# Altium schematic sheet motion_tracker.SchDoc
size A3; SheetNumber: 1; SheetTotal: 1
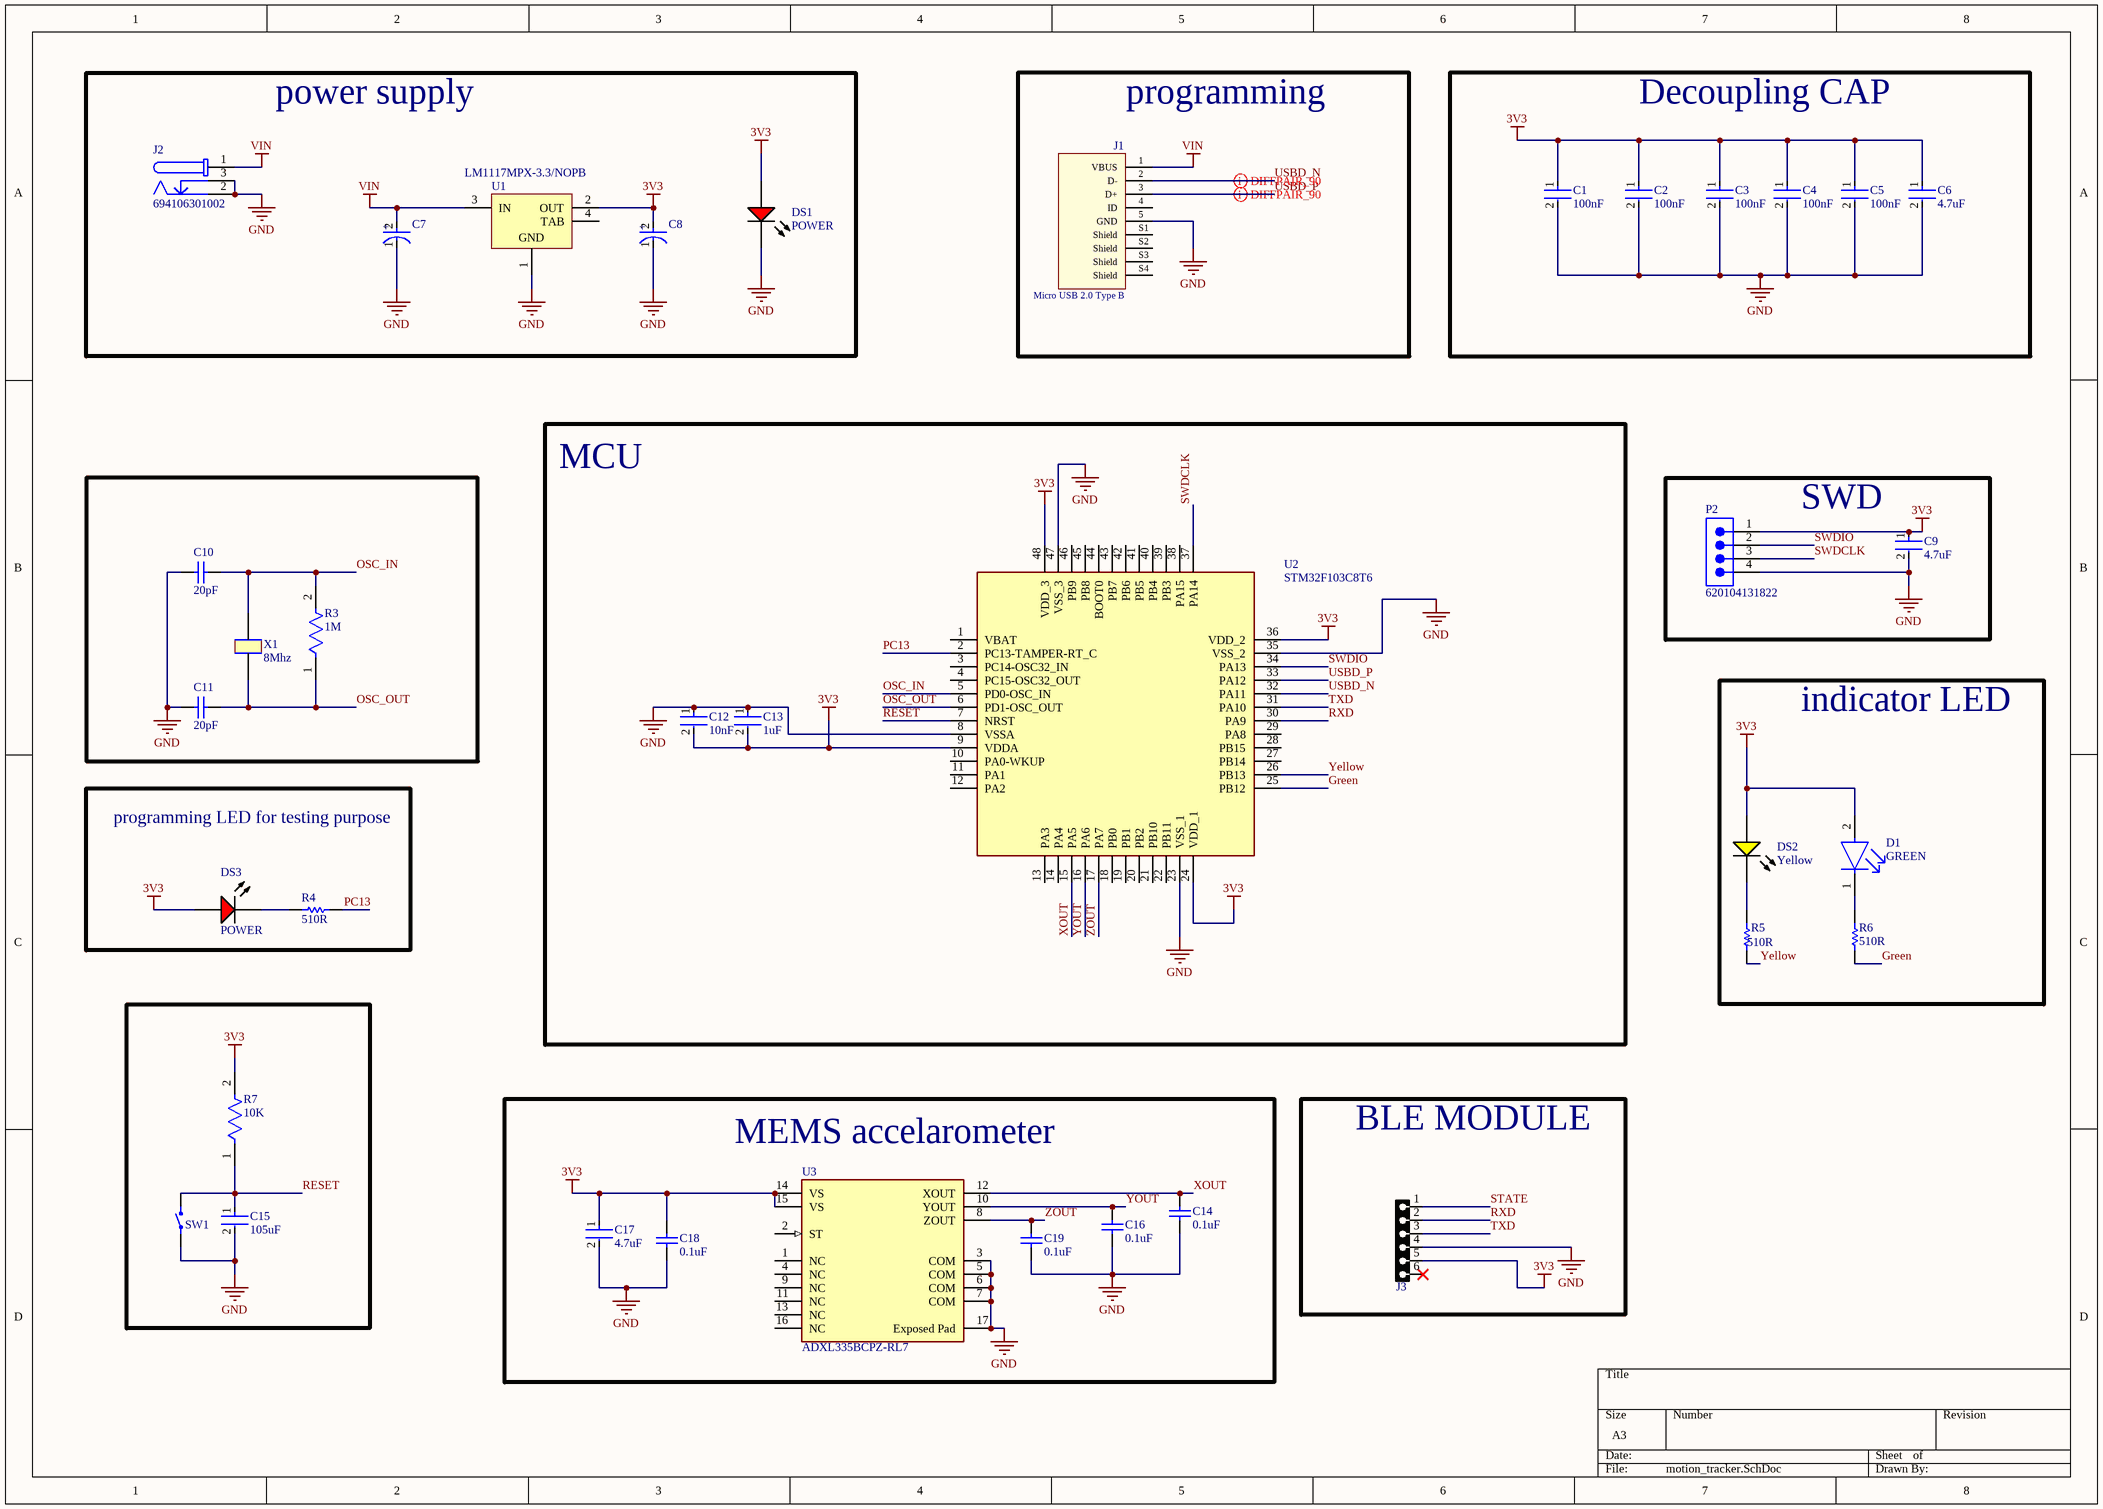
[diagram p0: motion_tracker.SchDoc]

## Parts
C1  100nF  [FP-0603-L_1_6_0_15-W_0_81-IPC_C]
C2  100nF  [FP-0603-L_1_6_0_15-W_0_81-IPC_C]
C3  100nF  [FP-0603-L_1_6_0_15-W_0_81-IPC_C]
C4  100nF  [FP-0603-L_1_6_0_15-W_0_81-IPC_C]
C5  100nF  [FP-0603-L_1_6_0_15-W_0_81-IPC_C]
C6  4.7uF  [FP-0603-L_1_6_0_15-W_0_81-IPC_A]
C7  EEEFP1C100AR  [FP-FPB-MFG]  (value not drawn)
C8  EEEFP1C100AR  [FP-FPB-MFG]  (value not drawn)
C9  4.7uF  [FP-0603-L_1_6_0_15-W_0_81-IPC_A]
C10  20pF  [CAPC1608X90X35NL15T15]
C11  20pF  [CAPC1608X90X35NL15T15]
C12  10nF  [FP-0603-L_1_6_0_15-W_0_81-IPC_C]
C13  1uF  [FP-0603-L_1_6_0_15-W_0_81-IPC_C]
C14  0.1uF  [CAPC1608X90X35LL15T15]
C15  105uF  [FP-0603-L_1_6_0_15-W_0_81-IPC_C]
C16  0.1uF  [CAPC1608X90X35LL15T15]
C17  4.7uF  [FP-0603-L_1_6_0_15-W_0_81-IPC_A]
C18  0.1uF  [CAPC1608X90X35LL15T15]
C19  0.1uF  [CAPC1608X90X35LL15T15]
D1  GREEN  [FP-LTST-C190GKT-MFG]
DS1  POWER  [AVAG-HSMX-C190_V]
DS2  Yellow  [AVAG-HSMX-C190_V]
DS3  POWER  [AVAG-HSMX-C190_V]
J1  Micro USB 2.0 Type B  [629105136821]
J2  694106301002  [694106301002]
J3  HDRF6  [HDRLP_F_1X6]  (value not drawn)
P2  620104131822  [620104131822]
R3  1M  [FP-ERJ3EK-IPC_C]
R4  510R  [RESC1608X55X30ML15T15]
R5  510R  [RESC1608X55X30ML15T15]
R6  510R  [RESC1608X55X30ML15T15]
R7  10K  [FP-CRCW0603-HPe3-MFG]
SW1  Tactile 2PIN 6X3.5mm H4.57mm (SMD)  [SWPBS_SPST_6X3X5]  (value not drawn)
U1  LM1117MPX-3.3/NOPB  [DCY0004A_L]
U2  STM32F103C8T6  [LQFP-48_19.6_393_58X11_SMD]
U3  ADXL335BCPZ-RL7  [FP-CP-16-14-MFG]
X1  8Mhz  [XTAL_314_240X47_SMD]

## Blocks framed on the sheet
power supply: C7 C8 DS1 J2 U1
programming: J1
Decoupling CAP: C1-C6
MCU: C12 C13 U2
SWD: C9 P2
indicator LED: D1 DS2 R5 R6
programming LED for testing purpose: DS3 R4
MEMS accelarometer: C14 C16-C19 U3
BLE MODULE: J3

## Nets
3V3: C1.1 C2.1 C3.1 C4.1 C5.1 C6.1 C8.2(A) C9.1 C12.2 C13.2 C17.1 C18.2 D1.2(A) DS1.1(A) DS2.1(A) DS3.1(A) J3.5 P2.1 R7.2 U1.2(OUT) U2.9(VDDA) U2.24(VDD_1) U2.36(VDD_2) U2.48(VDD_3) U3.14(VS) U3.15(VS)
GND: C1.2 C2.2 C3.2 C4.2 C5.2 C6.2 C7.1(C) C8.1(C) C9.2 C10.1 C11.1 C12.1 C13.1 C14.1 C15.2 C16.1 C17.2 C18.1 C19.1 DS1.2(K) J1.5(GND) J2.2 J2.3 J3.4 P2.4 SW1.1 U1.1(GND) U2.8(VSSA) U2.23(VSS_1) U2.35(VSS_2) U2.47(VSS_3) U3.3(COM) U3.5(COM) U3.6(COM) U3.7(COM) U3.17(Exposed_Pad)
VIN: C7.2(A) J1.1(VBUS) J2.1 U1.3(IN)
Green: R6.2 U2.25(PB12)
OSC_IN: C10.2 R3.2 U2.5(PD0-OSC_IN) X1.2
OSC_OUT: C11.2 R3.1 U2.6(PD1-OSC_OUT) X1.1
PC13: R4.2 U2.2(PC13-TAMPER-RT_C)
RESET: C15.1 R7.1 SW1.2 U2.7(NRST)
RXD: J3.2 U2.30(PA9)
STATE: J3.1
SWDCLK: P2.3 U2.37(PA14)
SWDIO: P2.2 U2.34(PA13)
TXD: J3.3 U2.31(PA10)
USBD_N: J1.2(D-) U2.32(PA11)
USBD_P: J1.3(D+) U2.33(PA12)
XOUT: C14.2 U2.15(PA5) U3.12(XOUT)
Yellow: R5.2 U2.26(PB13)
YOUT: C16.2 U2.16(PA6) U3.10(YOUT)
ZOUT: C19.2 U2.17(PA7) U3.8(ZOUT)
NetD1_1: D1.1(C) R6.1
NetDS2_2: DS2.2(K) R5.1
NetDS3_2: DS3.2(K) R4.1

Not connected (* = marked no-connect by the designer): J1 4(ID) S1(Shield) S2(Shield) S3(Shield) S4(Shield); J3 6*; U1 4(TAB); U2 1(VBAT) 3(PC14-OSC32_IN) 4(PC15-OSC32_OUT) 10(PA0-WKUP) 11(PA1) 12(PA2) 13(PA3) 14(PA4) 18(PB0) 19(PB1) 20(PB2) 21(PB10) 22(PB11) 27(PB14) 28(PB15) 29(PA8) 38(PA15) 39(PB3) 40(PB4) 41(PB5) 42(PB6) 43(PB7) 44(BOOT0) 45(PB8) 46(PB9); U3 1(NC) 2(ST) 4(NC) 9(NC) 11(NC) 13(NC) 16(NC)

## Layout directives
differential pair; net class diff_90; differential pair class diff_90: USBD_N, USBD_P

## Notes on the sheet
- (in symbol CMP-00287-07742837-1) +

## Library data of the parts
C1-C5 C12 C13 C15 = CMP-2006-04386-2: Automotive Ceramic Capacitor, 0603, 100nF, 10%, X7R, 15%, 50V; Dissipation Factor: 2.5%; Insulation Resistance: 100GR; Package Quantity: 1; Radiation Hardening: No; Contact Plating: Tin; Width: 0.032inch; Voltage Rating (DC): 50V; Dielectric Material: Ceramic; Length: 1.6mm; Thickness: 0.035inch; Min Operating Temperature: -55°C; Voltage: 50V; Depth: 0.81mm; Max Operating Temperature: 125°C; Series: -; Dielectric: X7R; Tolerance: 10%; Mount: Surface Mount; Termination: SMD/SMT; Ratings: AEC-Q200; Lead Free: Lead Free; Case Code (Imperial): 0603; Case/Package: 0603; Voltage Rating: 50V; Case Code (Metric): 1608; Capacitance: 100nF; RoHS Compliant: Yes; Number of Pins: 2; REACH SVHC: No SVHC; Construction: Flat; Height: 0.9mm; Packaging: Tape and Reel
C6 C9 C17 = CMP-2006-04482-2: General Purpose Ceramic Capacitor, 0603, 4.7uF, 20%, X5R, 15%, 6.3V; Insulation Resistance: 10GR; Dissipation Factor: 12.5%; Case/Package: 0603; Lead Free: Lead Free; Series: -; Size: 0.94mm; Min Operating Temperature: -55°C; Construction: Flat; Thickness: 0.035inch; RoHS Compliant: Yes; Mount: Surface Mount; Voltage Rating (DC): 6.3V; Termination: SMD/SMT; Length: 1.6mm; Depth: 0.81mm; Radiation Hardening: No; Tolerance: 20%; Height: 0.9mm; Capacitance: 4.7uF; Dielectric Material: Ceramic; Number of Pins: 2; Contact Plating: Tin; Width: 0.032inch; Case Code (Imperial): 0603; Voltage Rating: 6.3V; REACH SVHC: No SVHC; Package Quantity: 1; Max Operating Temperature: 85°C; Voltage: 6.3V; Case Code (Metric): 1608; Packaging: Tape and Reel; Dielectric: X5R
C7 C8 = CMP-00287-07742837-1: EEEFP1C100AR Aluminum Electrolytic Capacitor, 10 uF, 16 V, ± 20%, 2000 hours @ 105°C, Radial Can - SMD; Leakage Current: 3µA; Voltage Rating: 16V; ESR (Equivalent Series Resistance): 850mΩ; Capacitance: 10µF; Ripple Current (AC): 160mA; Dissipation Factor: 16%; Material: Aluminium; Height: 5.8mm; Min Operating Temperature: -55°C; Case/Package: Radial; Packaging: Cut Tape; Lifecycle Status: Production; Lead Pitch: 1mm; Tolerance: 20%; Contact Plating: Tin; Diameter: 4mm; Lead Free: Lead Free; Voltage: 16V; Max Operating Temperature: 105°C; Voltage Rating (DC): 16V; Height - Seated (Max): 5.7912mm; Schedule B: 8532220020, 8532220020; Termination: SMD/SMT; Number of Pins: 2; RoHS: Compliant; REACH SVHC: No SVHC; Ripple Current: 160mA; Mount: PCB, Surface Mount; Radiation Hardening: No; Life (Hours): 2000hours; Features: High Temperature; NexarPartId: 7742837; Length: 6.1mm
C10 C11 = CMP-2006-04264-1: Part Number: 06035A200JAT2A; Manufacturer: AVX Interconnect / Elco
C14 C16 C18 C19 = CMP-2006-02168-1: Manufacturer: AVX Interconnect / Elco; Part Number: LD035C104KAB2A
D1 = CMP-22017-000005-2: LED GREEN CLEAR CHIP SMD; Dominant Wavelength: 569nm; Reverse Voltage: 5V; Lens Color: Colorless; Viewing Angle: 130°; Voltage: 2V; Forward Current: 30mA; Power Dissipation: 100mW; Luminous Intensity: 6mcd; Number of LEDs: 1; Forward Voltage: 2.1V; Wavelength: 565nm; Test Current: 10mA; Min Operating Temperature: -55°C; Lens Style: Clear; Mount: Surface Mount; Width: 0.8mm; Packaging: Tape and Reel; Lens Transparency: Clear; Case Code (Metric): 1608; Depth: 0.8mm; Case Code (Imperial): 0603; Case/Package: 0603; Number of Pins: 2; Max Operating Temperature: 85°C; Lead Free: Lead Free; Number of Elements: 1; Length: 1.6mm; Height: 0.8mm; Package Quantity: 1; Power Rating: 100mW; Radiation Hardening: No; Illumination Color: Green; Color: Green
DS1 DS3 = CMP-2000-06427-1: LED Uni-Color Red, 52 mW, 20 mA, -40 to 85 degC, 2-Pin SMD, RoHS, Tape and Reel; Manufacturer: Avago; Reverse Voltage: 5V; Viewing Angle: 170deg; High Brightness: No; Lens Type: ColorlessDiffused; DELETED: Compliant; Product Height (mm): 0.8mm; Dominant Wave Length: 626nm; Number of  Elements: 1; Chip Material: GaP; Lum Intensity: 10mcd; Product Length (mm): 1.6mm; Forward Voltage: 2.6V; Power Dissipation: 52W; Shape Type: Rectangular; Forward Current: 25mA; Peak Wavelength: 630nm; Test Current (It): 20mA; Main Category: ChipLED; Lens Dimensions: 1x0.8x0.5mm; Pin Count: 2; Package Reference: HSMX-C190; Mounting Technology: SurfaceMount; Mounting: SurfaceMount; Datasheet URL: http://docs.avagotech.com/docs/AV02-0551EN; Package Type: ChipLed; Operating Temperature Classification: Industrial; Datasheet Version: 03/2012; Operating Temp Range: -40Cto85C; Emitting Color: Red; Rad Hardened: No; Manufacturer URL: http://www.avagotech.com/; Luminous Intensity: 10mcd; Package Description: 2-Pin Surface Mount Device, Body 1.6 x 0.8 mm, Height 0.9 mm; Type: Uni-Color; Packaging: TapeandReel; Product Depth (mm): 0.8mm
DS2 = CMP-1744-00003-1: LED Uni-Color Yellow, 65 mW, 20 mA, -40 to 85 degC, 2-Pin SMD, RoHS, Tape and Reel; Tolerance: 1%; Voltage Rating: 50 V; Power Rating: 100 mW; Case\Package: 0603; Resistance: 390 Ohm; Min Operating Temperature: -55 degC; Length: 1.6 mm; ComponentLink3Description: Package Specification; Mount: Surface Mount; PackageReference: HSMX-C190; ComponentLink2Description: Datasheet; DatasheetVersion: Mar-12; Case Code (Metric): 1608; Pins: 2; Package Quantity: 5000; ComponentLink2URL: http://docs.avagotech.com/docs/AV02-0551EN; ComponentLink1Description: Manufacturer URL; RoHSCompliant: true; Packaging: Tape and Reel; PackageDescription: 2-Pin Surface Mount Device, Body 1.6 x 0.8 mm, Height 0.9 mm; REACH SVHC: No SVHC; ComponentLink3URL: http://www.fairchildsemi.com/dwg/MA/MA03D.pdf; Voltage Rating (DC): 50 V; Width: 0.8 mm; ComponentLink1URL: http://www.avagotech.com/; Max Operating Temperature: 155 degC; Case Code (Imperial): 0603; Height: 0.45 mm
J1 = Micro USB 2.0 Type B Horizonta (SMD) 629105136821: Micro USB 2.0 Type B Horizontal SMT 5 Contacts WR-COM; Rated Current: 1 A; Gender: Female; ComponentLink1Description: Manufacturer; ComponentLink1URL: http://www.we-online.de; ComponentLink2Description: Datasheet; ComponentLink2URL: http://katalog.we-online.de/em/datasheet/629105136821.pdf; PartNumber: 629105136821; Published Date: May 2018; Publisher: Wurth Elektronik; Orientation: Horizontal; Interface Type: Micro USB 2.0 Type B; Operating Temperature: -40 to 85 degC; Mounting Technology: SMT; Packaging: Tape and Reel
J2 = CMP-1502-00188-2: NexarPartId: 52676100; Voltage Rating (DC): 20V; Gender: Male; Voltage Rating: 24V; Connector Type: Power; Insulation Resistance: 100MΩ; Current Rating: 5A; Shielding: Unshielded; Number of Contacts: 3; Color: Black; Housing Material: Polyamide; Contact Gender: Female; REACH SVHC: Unknown; Termination: Through Hole; Height: 11mm; RoHS: Compliant; Mount: Through Hole; Flammability Rating: UL94 V-0; Packaging: Bulk; Min Operating Temperature: -40°C; Contact Plating: Tin; Max Operating Temperature: 85°C; Operating Supply Voltage: 24V; Contact Material: Gold, Tin
J3 = HDRLP_F_1X6: CONN, HEADER, Male, pitch: 2.54mm, 6POS; VALUE: HDRF6
P2 = CMP-1502-00671-2: NexarPartId: 18818240; Number of Positions: 4; Operating Supply Voltage: 100V; Connector Type: Male Pin; Insulation: Insulated; Pitch: 2mm; Insulation Resistance: 1GΩ; Contact Resistance: 20mΩ; Voltage Rating: 125V; Current Rating: 2A; Gender: Male; Width: 12mm; Flammability Rating: UL94 V-0; Contact Gender: Male; REACH SVHC: Unknown; Packaging: Tape and Reel; Contact Plating: Tin; Termination: SMD/SMT; Number of Rows: 1; Mount: Surface Mount; Contact Mating Length: 3.683mm; Lead Free: Lead Free; Housing Material: Nylon; Number of Contacts: 4; RoHS: Compliant; Min Operating Temperature: -40°C; Number of Pins: 4; Length: 12mm; Height: 5.6mm; Max Operating Temperature: 85°C; Color: Beige, White; Contact Material: Copper; Lead Pitch: 2mm
R3 = CMP-1012-00849-3: RES SMD 1M OHM 1% 1/10W 0603; Resistance: 1MR; Voltage Rating: 75V; Temperature Coefficient: 100ppm/°C; Power Rating: 100mW; REACH SVHC: No SVHC; Radiation Hardening: No; Features: Automotive AEC-Q200; Case Code (Metric): 1608; Resistance Tolerance: 1%; Case/Package: 0603; Termination: SMD/SMT; Max Operating Temperature: 155°C; Tolerance: 1%; Size Code: 0603; Case Code (Imperial): 0603; Min Operating Temperature: -55°C; Number of Pins: 2; Mount: Surface Mount; Package Quantity: 1; Military Standard: Not; Voltage Rating (DC): 75V; Depth: 0.8mm; Packaging: Tape and Reel; Width: 0.8mm; Number of Terminations: 2; Length: 1.6mm; Height: 0.022inch; RoHS Compliant: Yes; Resistor Type: Thick Film; Contact Plating: Tin; Lead Free: Lead Free; Series: ERJ; Construction: Rectangular; Max Power Dissipation: 100mW
R4-R6 = CMP-2000-00802-1: Manufacturer: Panasonic; Part Number: ERJ-3GEYJ511V
R7 = CMP-2000-03835-2: RES SMD 10K OHM 1% 1/3W 0603; Resistance: 10kR; Voltage Rating (DC): 75V; Max Power Dissipation: 250mW; Temperature Coefficient: 100ppm/°C; Case Code (Metric): 1608; Features: Automotive AEC-Q200; Termination: SMD/SMT; Number of Terminations: 2; Case Code (Imperial): 0603; Tolerance: 1%; Depth: 0.85mm; Package Quantity: 10; Length: 1.6mm; Packaging: Tape and Reel; Contact Plating: Tin; Radiation Hardening: No; Case/Package: 0603; Composition: Thick Film; Voltage Rating: 75V; Weight: 7.1E-05oz; Max Operating Temperature: 155°C; Lead Free: Lead Free; Width: 0.033inch; Power Rating: 250mW; Min Operating Temperature: -55°C; Military Standard: Not; Height: 0.45mm
SW1 = Tactile 2PIN 6X3.5mm H4.57mm (SMD): Tactile Switch SPST-NO Top Actuated Surface Mount; PartNumber: FSMSMTR-ND
U1 = CMP-0062-01639-4: 800mA Low-Dropout Linear Regulator, 4-pin SOT-223, Pb-Free; Manufacturer: Texas Instruments; High-Reliability: Y; PowerWise: N; PackageTopMarking: XYTT*N05A; CompType: LDO IC; ComponentLink1URL: http://www.ti.com/general/docs/lit/getliterature.tsp?genericPartNumber=LM1117-N&fileType=pdf; PartNumber: LM1117MPX-3.3/NOPB; ComponentLink1Description: Datasheet URL; PinCount: 4; Code_JEDEC: TO-261-AA; PackageDescription: Molded SOT-223, 6.50 x 3.56 x 1.6mm Body, 4 Lead, 2.3mm Pitch; PackageReference: DCY0004A; RoHS: Y; Code_IPC: SOT223-4
U2 = IC_STM32F103C8T6: ARM® Cortex®-M3 STM32F1 Microcontroller IC 32-Bit 72MHz 64KB (64K x 8) FLASH 48-LQFP (7x7); Manufacturer: STMicroelectronics; Alternate Part Number-1: NA; Manufacturer Part Number: STM32F103C8T6; Case/Package: LQFP48; Supplier-1: LCSC; Supplier Part Number-1: STM32F103C8T6
U3 = CMP-0885-00044-2: ACCELEROMETER 3G ANALOG 16LFCSP; Nominal Supply Current: 350uA; Min Supply Voltage: 1.8V; Bandwidth: 550Hz; Sensitivity: 300mV/g; -3db Bandwidth: 1.6kHz; Max Supply Voltage: 3.6V; Axis: X, Y, Z; Contact Plating: Tin; Packaging: Tape and Reel; Length: 4mm; Min Operating Temperature: -40°C; Number of Pins: 16; Max Operating Temperature: 85°C; Operating Supply Current: 350uA; Lead Free: Contains Lead; Radiation Hardening: No; Package Quantity: 1000; Depth: 4mm; Output Type: Analog; Case/Package: LFCSP EP
X1 = XTAL_8MHZ-ECS-80-32-5PX-SMD: 8MHz ±30ppm Crystal 32pF 60 Ohms HC-49/US; Manufacturer: Fox Electronics; Manufacturer Part Number: ECS-80-32-5PX-TR; Alternate Part Number-1: NA; Case/Package: SMD/SMT; Supplier-1: SP ROAD; Supplier Part Number-1: ECS-80-32-5PX-TR